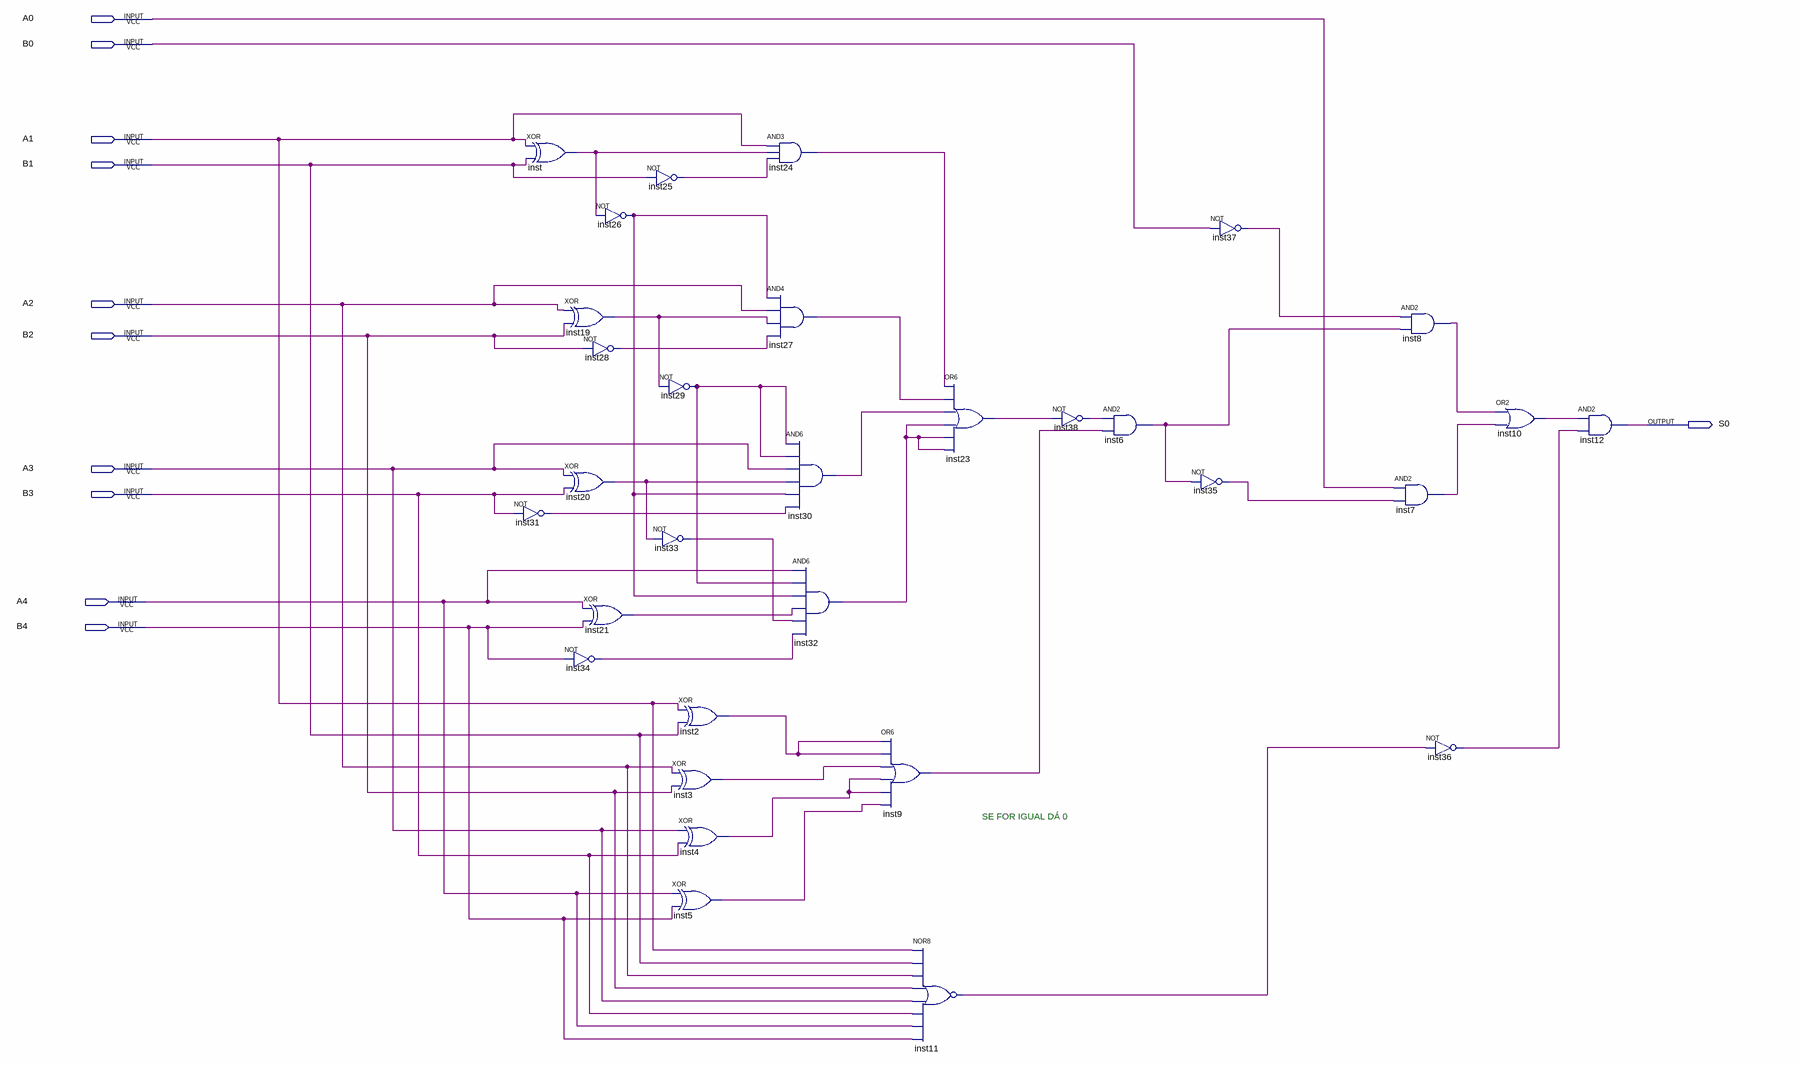
[diagram p0: schematic sheet]
// Quartus schematic projeto.bdf as structural Verilog: 31 symbols, 11 pins
module projeto (
  input  A0,
  input  B0,
  input  A1,
  input  B1,
  input  A2,
  input  B2,
  input  A3,
  input  B3,
  input  A4,
  input  B4,
  output S0
);

  wire inst2_out, inst3_out, inst4_out, inst5_out, inst6_out, inst7_out, inst8_out, inst9_out, inst10_out,
       inst11_out, inst19_out, inst20_out, inst21_out, inst23_out, inst24_out, inst25_out, inst26_out,
       inst27_out, inst28_out, inst29_out, inst30_out, inst31_out, inst32_out, inst33_out, inst34_out,
       inst35_out, inst36_out, inst37_out, inst38_out, inst_out;

  xor inst (inst_out, A1, B1);
  not inst31 (inst31_out, B3);
  xor inst19 (inst19_out, A2, B2);
  not inst28 (inst28_out, B2);
  xor inst20 (inst20_out, A3, B3);
  xor inst21 (inst21_out, A4, B4);
  not inst34 (inst34_out, B4);
  not inst26 (inst26_out, inst_out);
  not inst25 (inst25_out, B1);
  not inst29 (inst29_out, inst19_out);
  not inst33 (inst33_out, inst20_out);
  xor inst2 (inst2_out, A1, B1);
  xor inst3 (inst3_out, A2, B2);
  xor inst4 (inst4_out, A3, B3);
  xor inst5 (inst5_out, A4, B4);
  and inst24 (inst24_out, A1, inst_out, inst25_out);
  and inst27 (inst27_out, inst26_out, A2, inst19_out, inst28_out);
  and inst30 (inst30_out, inst29_out, inst29_out, A3, inst20_out, inst26_out, inst31_out);
  and inst32 (inst32_out, A4, inst29_out, inst26_out, inst21_out, inst33_out, inst34_out);
  or inst9 (inst9_out, inst2_out, inst2_out, inst3_out, inst4_out, inst4_out, inst5_out);
  nor inst11 (inst11_out, A1, B1, A2, B2, A3, B3, A4, B4);
  or inst23 (inst23_out, inst24_out, inst27_out, inst30_out, inst32_out, inst32_out, inst32_out);
  not inst38 (inst38_out, inst23_out);
  and inst6 (inst6_out, inst38_out, inst9_out);
  not inst35 (inst35_out, inst6_out);
  not inst37 (inst37_out, B0);
  and inst7 (inst7_out, A0, inst35_out);
  and inst8 (inst8_out, inst37_out, inst6_out);
  not inst36 (inst36_out, inst11_out);
  or inst10 (inst10_out, inst8_out, inst7_out);
  and inst12 (S0, inst10_out, inst36_out);

  // Notes on the sheet:
  //   SE FOR IGUAL DÁ 0
endmodule
